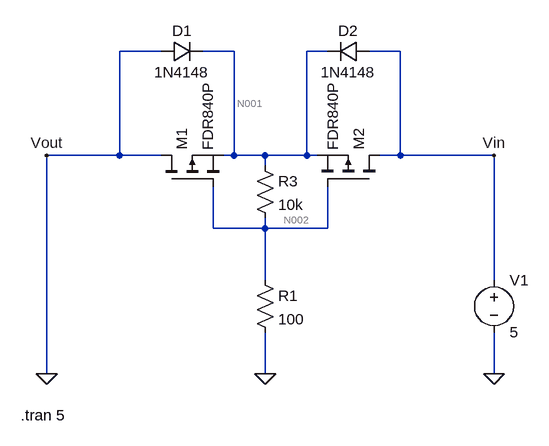
[diagram p0: schematic USBCameraConnector.asc]
USBCameraConnector.asc, the LTspice schematic file:
Version 4.1
SHEET 1 880 680
WIRE 48 -48 -16 -48
WIRE 160 -48 112 -48
WIRE 304 -48 272 -48
WIRE 416 -48 368 -48
WIRE -16 112 -16 -48
WIRE -16 112 -128 112
WIRE 48 112 -16 112
WIRE 160 112 160 -48
WIRE 160 112 144 112
WIRE 208 112 160 112
WIRE 272 112 272 -48
WIRE 272 112 208 112
WIRE 288 112 272 112
WIRE 416 112 416 -48
WIRE 416 112 384 112
WIRE 560 112 416 112
WIRE 208 128 208 112
WIRE 128 224 128 160
WIRE 208 224 208 208
WIRE 208 224 128 224
WIRE 304 224 304 160
WIRE 304 224 208 224
WIRE 208 304 208 224
WIRE 560 304 560 112
WIRE -128 448 -128 112
WIRE 208 448 208 384
WIRE 560 448 560 384
FLAG -128 448 0
FLAG 208 448 0
FLAG 560 448 0
FLAG -128 112 Vout
FLAG 560 112 Vin
SYMBOL pmos 384 160 M270
SYMATTR InstName M2
SYMATTR Value FDR840P
SYMBOL pmos 48 160 R270
SYMATTR InstName M1
SYMATTR Value FDR840P
SYMBOL voltage 560 288 R0
WINDOW 123 0 0 Left 0
WINDOW 39 0 0 Left 0
SYMATTR InstName V1
SYMATTR Value 5
SYMBOL res 192 288 R0
SYMATTR InstName R1
SYMATTR Value 100
SYMBOL diode 48 -32 R270
WINDOW 0 32 32 VTop 2
WINDOW 3 0 32 VBottom 2
SYMATTR InstName D1
SYMATTR Value 1N4148
SYMBOL diode 368 -64 R90
WINDOW 0 0 32 VBottom 2
WINDOW 3 32 32 VTop 2
SYMATTR InstName D2
SYMATTR Value 1N4148
SYMBOL res 192 112 R0
SYMATTR InstName R3
SYMATTR Value 10k
TEXT -168 512 Left 2 !.tran 5

The netlist it stands for:
* USBCameraConnector.asc
M2 Vin N002 N001 N001 FDR840P
M1 0 N002 N001 N001 FDR840P
V1 Vin 0 5
R1 N002 0 100
D1 0 N001 1N4148
D2 Vin N001 1N4148
R3 N001 N002 10k
.model D D
.lib standard.dio
.model NMOS NMOS
.model PMOS PMOS
.lib standard.mos
.tran 5
.backanno
.end

* Results of the author's LTspice run, read from the files saved beside the schematic
* Operating Point, zero values left out:
*   V(n002) = 37.55 mV
*   V(vin) = 5 V
*   V(n001) = 3.793 V
*   I(V1) = -183 A
*   Id(M2) = 182.4 A
*   Is(M2) = -182.4 A
*   I(D1) = -2.524 nA
*   I(D2) = 588.1 mA
*   Id(M1) = -183 A
*   Is(M1) = 183 A
*   I(R3) = 375.5 µA
*   I(R1) = 375.5 µA